# EAGLE schematic V2-1layer (EAGLE 9.6.2)
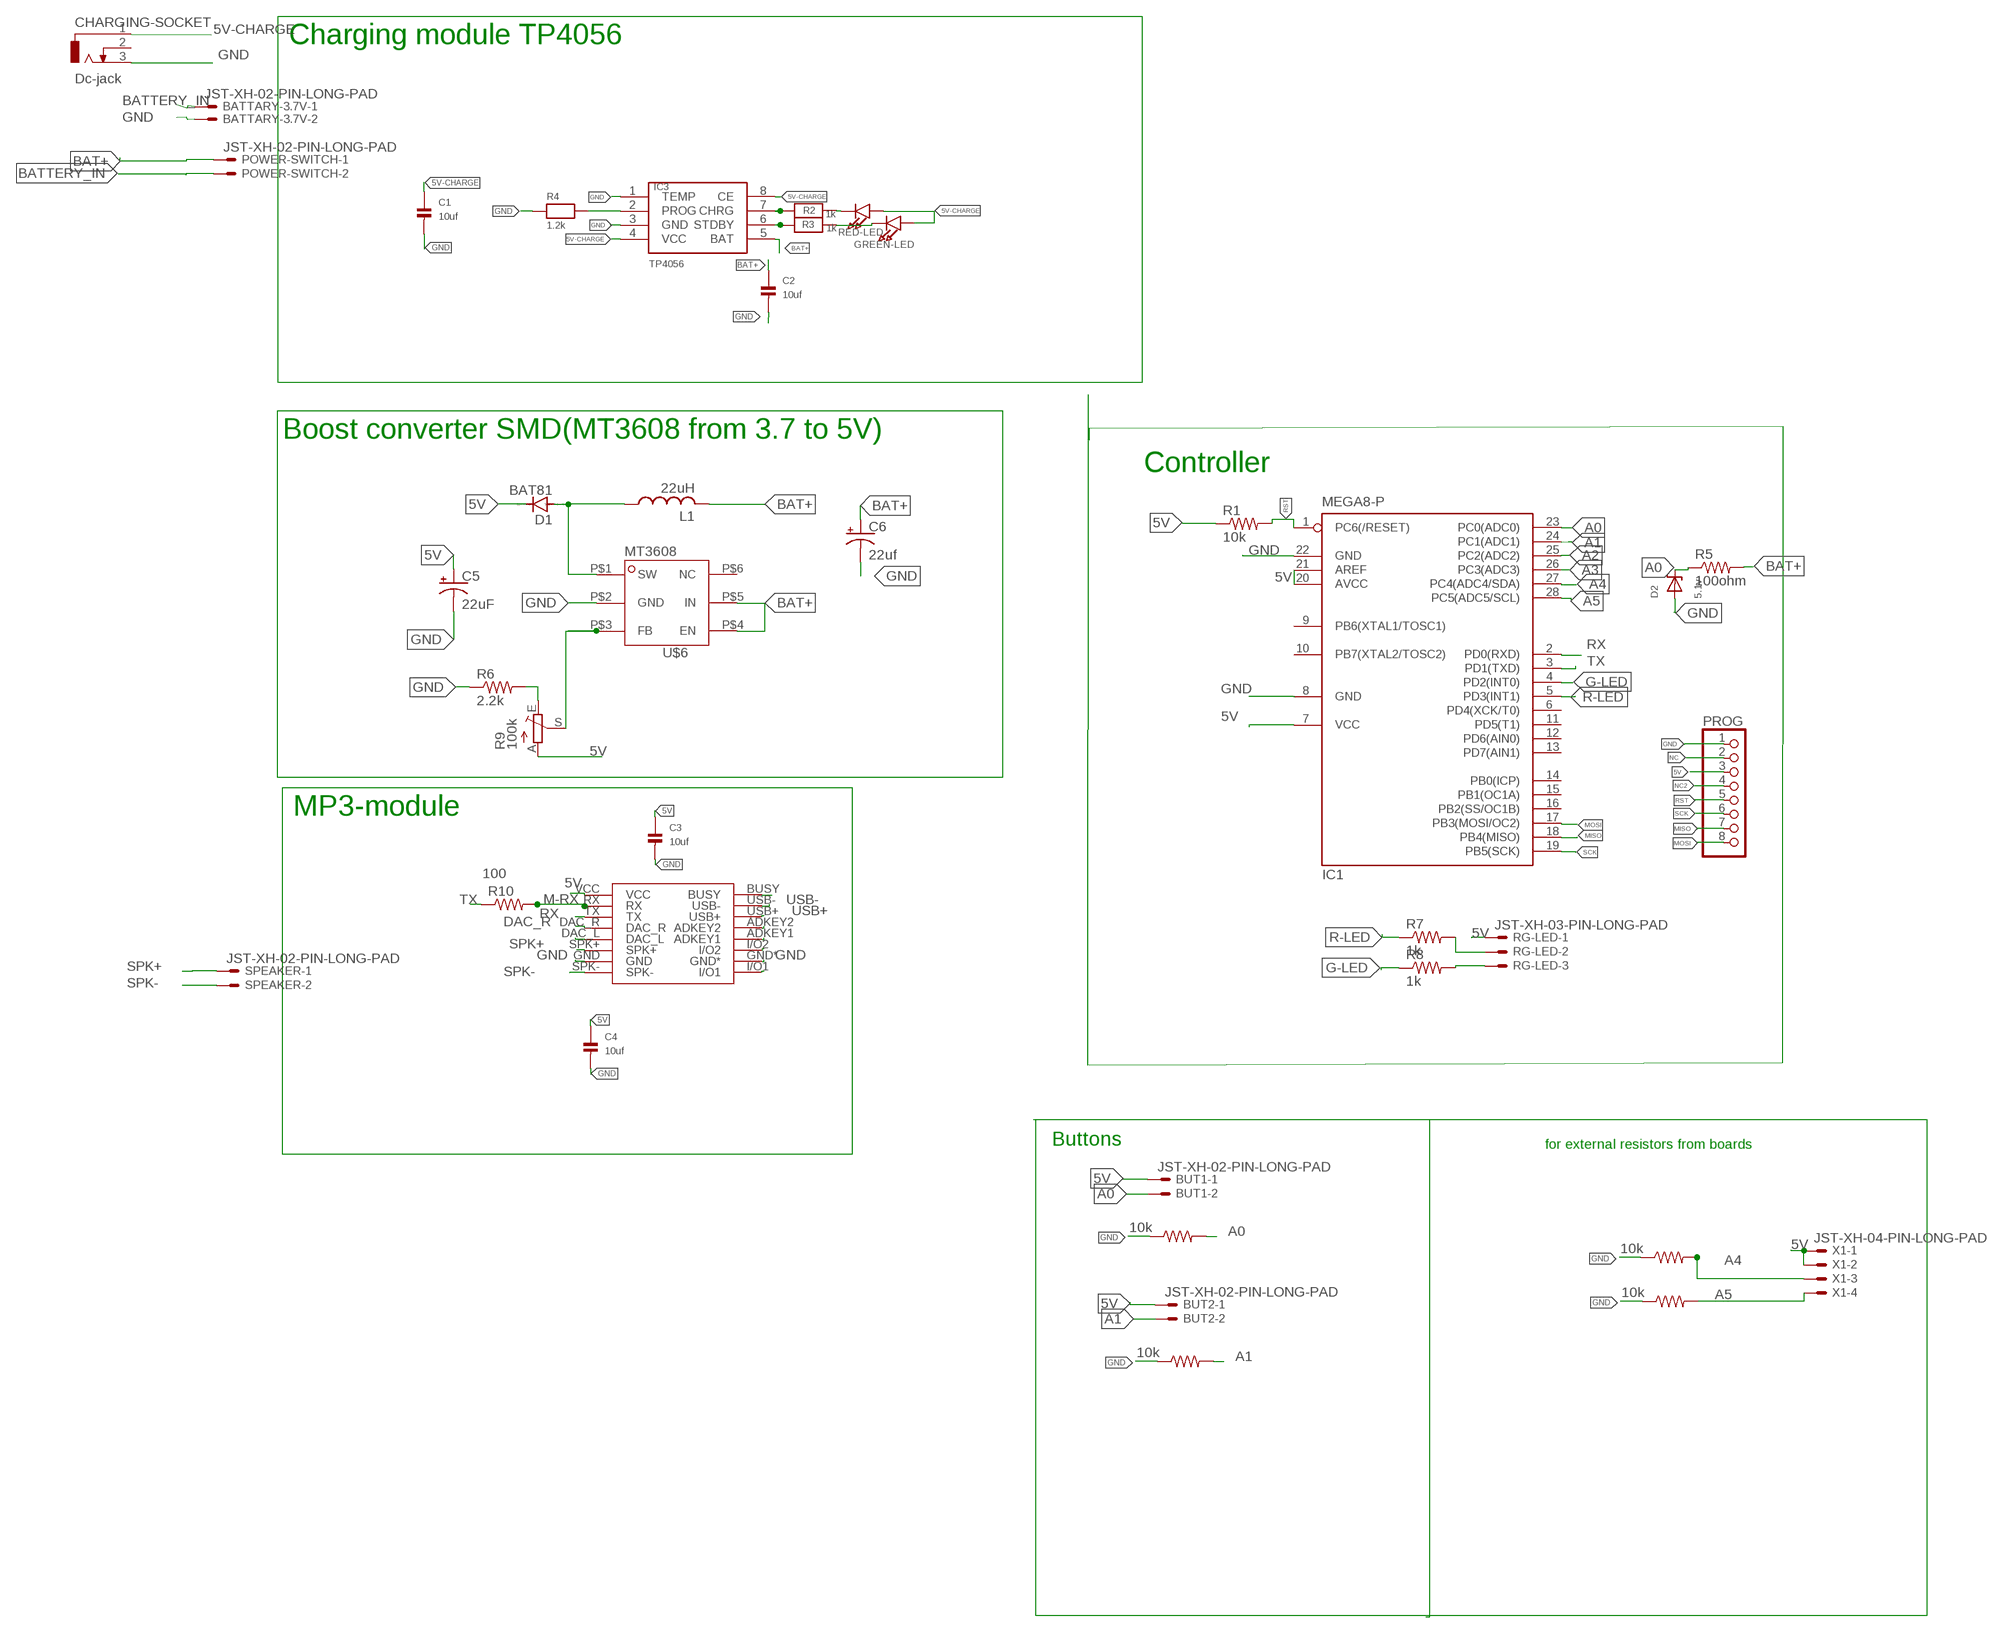
[diagram p0: schematic, sheet 1]

## Parts
BATTARY-3.7V  JST-XH-02-PIN-LONG-PAD  [JST-XH-02-PACKAGE-LONG-PAD]
BUT1  JST-XH-02-PIN-LONG-PAD  [JST-XH-02-PACKAGE-LONG-PAD]
BUT2  JST-XH-02-PIN-LONG-PAD  [JST-XH-02-PACKAGE-LONG-PAD]
C1  10uf  CAP_CERAMIC0805  [0805]
C2  10uf  CAP_CERAMIC0805  [0805]
C3  10uf  CAP_CERAMIC0805  [0805]
C4  10uf  CAP_CERAMIC0805  [0805]
C5  22uF  CPOL-USE2,5-6E  [E2,5-6E]
C6  22uf  CPOL-USE2,5-6E  [E2,5-6E]
CHARGING-SOCKET  Dc-jack  CON_JACK  [DCJ0303]
D1  BAT81  [DO34-7]
D2  5.1v  DIODE-ZENER  [SMADIODE]
GREEN-LED  LED0805  [CHIPLED_0805]
IC1  MEGA8-P  [DIL28-3]
IC3  TP4056  [SOP-8]
KEYPADS  10k  RES-7  [0204/7]
KEYPADS1  10k  RES-7  [0204/7]
KEYPADS2  10k  RES-7  [0204/7]
KEYPADS3  10k  RES-7  [0204/7]
L1  22uH  L-USL1812  [L1812]
POWER-SWITCH  JST-XH-02-PIN-LONG-PAD  [JST-XH-02-PACKAGE-LONG-PAD]
PROG  PINHD-1X8  [1X08]
R1  10k  R-US_0204/7  [0204/7]
R2  1k  RESISTOR_0805  [_0805]
R3  1k  RESISTOR_0805  [_0805]
R4  1.2k  RESISTOR_0805  [_0805]
R5  100ohm  R-US_0204/7  [0204/7]
R6  2.2k  R-US_M0805  [M0805]
R7  1k  R-US_0204/7  [0204/7]
R8  1k  R-US_0204/7  [0204/7]
R9  100k  TRIM_EU-B25U  [B25U]
R10  100  RES-7  [0204/7]
RED-LED  LED0805  [CHIPLED_0805]
RG-LED  JST-XH-03-PIN-LONG-PAD  [JST-XH-03-PACKAGE-LONG-PAD]
SPEAKER  JST-XH-02-PIN-LONG-PAD  [JST-XH-02-PACKAGE-LONG-PAD]
U$2  MP3_MODULE  [MP3_MODULE]
U$6  MT3608SOT23-6  [SOT23-6]
X1  JST-XH-04-PIN-LONG-PAD  [JST-XH-04-PACKAGE-LONG-PAD]

## Nets
5V: BUT1.1 BUT2.1 C3.1 C4.1 C5.+ D1.C IC1.7(VCC) IC1.20(AVCC) IC1.21(AREF) PROG.3 R1.1 R9.A RG-LED.1 U$2.VCC X1.1 X1.2
5V-CHARGE: C1.1 CHARGING-SOCKET.1 GREEN-LED.A IC3.4(VCC) IC3.8(CE) RED-LED.A
A0: BUT1.2 D2.C IC1.23(PC0(ADC0)) KEYPADS.2 R5.1
A1: BUT2.2 IC1.24(PC1(ADC1)) KEYPADS3.2
A2: IC1.25(PC2(ADC2))
A3: IC1.26(PC3(ADC3))
A4: IC1.27(PC4(ADC4/SDA)) KEYPADS1.2 X1.3
A5: IC1.28(PC5(ADC5/SCL)) KEYPADS2.2 X1.4
BAT+: C2.1 C6.+ IC3.5(BAT) L1.2 POWER-SWITCH.1 R5.2 U$6.P$4(EN) U$6.P$5(IN)
BATTERY_IN: BATTARY-3.7V.1 POWER-SWITCH.2
DAC_L: U$2.DAC_L
DAC_R: U$2.DAC_R
G-LED: IC1.4(PD2(INT0)) R8.1
GND: BATTARY-3.7V.2 C1.2 C2.2 C3.2 C4.2 C5.- C6.- CHARGING-SOCKET.3 D2.A IC1.8(GND) IC1.22(GND) IC3.1(TEMP) IC3.3(GND) KEYPADS1.1 KEYPADS2.1 KEYPADS3.1 KEYPADS.1 PROG.1 R4.1 R6.1 U$2.GND U$2.GND* U$6.P$2(GND)
M-RX: R10.2 U$2.RX
MISO: IC1.18(PB4(MISO)) PROG.7
MOSI: IC1.17(PB3(MOSI/OC2)) PROG.8
N$5: IC3.2(PROG) R4.2
N$7: R7.2 RG-LED.2
N$8: U$2.BUSY
N$11: U$2.ADKEY2
N$12: U$2.ADKEY1
N$13: U$2.I/O2
N$15: U$2.I/O1
N$16: R8.2 RG-LED.3
N$17: IC3.7(CHRG) R2.1
N$18: IC3.6(STDBY) R3.1
N$20: GREEN-LED.C R3.2
N$21: R6.2 R9.E
N$22: R2.2 RED-LED.C
N$24: R9.S U$6.P$3(FB)
N$30: D1.A L1.1 U$6.P$1(SW)
NC: PROG.2
NC2: PROG.4
R-LED: IC1.5(PD3(INT1)) R7.1
RST: IC1.1(PC6(/RESET)) PROG.5 R1.2
RX: IC1.2(PD0(RXD)) U$2.TX
SCK: IC1.19(PB5(SCK)) PROG.6
SPK+: SPEAKER.1 U$2.SPK+
SPK-: SPEAKER.2 U$2.SPK-
TX: IC1.3(PD1(TXD)) R10.1
USB+: U$2.USB+
USB-: U$2.USB-
Unconnected: CHARGING-SOCKET.2 IC1.6(PD4(XCK/T0)) IC1.9(PB6(XTAL1/TOSC1)) IC1.10(PB7(XTAL2/TOSC2)) IC1.11(PD5(T1)) IC1.12(PD6(AIN0)) IC1.13(PD7(AIN1)) IC1.14(PB0(ICP)) IC1.15(PB1(OC1A)) IC1.16(PB2(SS/OC1B)) U$6.P$6(NC)

## Notes on the sheet
- Charging module TP4056
- Boost converter SMD(MT3608 from 3.7 to 5V)
- Controller
- MP3-module
- Buttons | for external resistors from boards

## Library data of the parts
BATTARY-3.7V BUT1 BUT2 POWER-SWITCH SPEAKER = connector-data - JST XH Connectors v1-0:JST-XH-02-PIN: JST XH Connector 2 Pin Wire to board connector. Pitch: 2,54 mm, (0.100") Number of pins: 2 Created by Rembrandt Electronics www.rembrandtelectronics.com
C1-C4 = microbuilder:CAP_CERAMIC: Ceramic Capacitors 0402 - 0402 Surface Mount Capacitors 16pF 50V 5% [Digikey: 445-4899-2-ND] 18pF 50V 5% [Digikey: 490-1281-2-ND] 22pF 50V 5% [Digikey: 490-1283-2-ND] 68pF 50V 5% [Digikey: 490-1289-2-ND] 0.1uF 10V 10% [Digikey: 490-1318-2-ND] 1.0uF 6.3V 10% [Digikey: 490-1320-2-ND] 0603 - 0603 Surface Mount Capacitors 16 pF 50V 5% [Digikey: 445-5051-2-ND] 22 pF 50V [Digikey: PCC220ACVTR-ND] 33 pF 50V 5% [Digikey: 490-1415-1-ND] 56pF 50V 5% [Digikey: 490-1421-1-ND] 220pF 50V 5% [Digikey: 445-1285-1-ND] 680 pF 50V 2200 pF 50V 5% C0G [Digikey: 445-1297-1-ND] 5600 pF 100V 5% X7R [Digikey: 478-3711-1-ND] 0.1 µF 25V 10% [Digikey: PCC2277TR-ND] 0.22 µF 16V 10% X7R [Digikey: 445-1318-1-ND] 1.0 µF 25V 10% [Digikey: 445-5146-2-ND] 0603 - RF Specific 3pF 250V +/-0.1pF RF [Digikey: 712-1347-1-ND] 18 pF 250V 5% [Digikey: 478-3505-1-ND or 712-1322-1-ND] 56 pF 250V 5% C0G RF [Digikey: 490-4867-1-ND] 68 pF 250V RF [Digikey: 490-4868-1-ND] 0805 - 0805 Surface Mount Capacitors 220 pF 250V 2% RF Ceramic Capacitor [Digikey: 712-1398-1-ND] 1000 pF 50V 2% NP0 Ceramic Capacitor [Digikey: 478-3760-1-ND] 0.1 µF 25V 10% Ceramic Capacitor [Digikey: PCC1828TR-ND] 1.0 µF 16V 10% Ceramic Capacitor[Digikey: 490-1691-2-ND] 10.0 µF 10V 10% Ceramic Capacitor[Digikey: 709-1228-1-ND] 10.0 uF 16V 10% Ceramic Capacitor [Digikey: 478-5165-2-ND] 47 uF 6.3V 20% Ceramic Capacitor [Digikey: 587-1779-1-ND or 399-5506-1-ND] 1206 - 1206 Surface Mount Capacitors 47uF 10V 20% Ceramic Capacitor [Digikey: 490-5528-1-ND or 399-5508-1-ND or 445-6010-1-ND] 100uF 6.3V -20%, +80% Y5V Ceramic Capacitor (Digikey: 490-4512-1-ND, Mouser: 81-GRM31CF50J107ZE1L)
C5 C6 = rcl:CPOL-US: POLARIZED CAPACITOR, American symbol; SPICEPREFIX: C
CHARGING-SOCKET = MIA_LIBRARY-2-2:CON_JACK: DC POWER JACK Source: DCJ0303.pdf; OC_FARNELL: unknown; OC_NEWARK: unknown
D1 = diode:BAT81: DIODE barrier diode
D2 = microbuilder:DIODE-ZENER: Zener Diode SMA: 30V 1W Zener Diode, 1.2Vf - Digikey: SMAZ30-FDICT-ND
GREEN-LED RED-LED = microbuilder:LED: LED 0603 - 0603 Surface Mount Package 2mA: Green LED - Low Power (3.9mcd, 2ma, 1.7Vf) - Digikey: 475-2709-2-ND Orange LED - Low Power (9.8mcd, 2ma, 1.8Vf) - Digikey: 475-1194-2-ND Red LED - Low Power (5mcd, 2ma, 1.8Vf) - Digikey: 475-1195-2-ND Yellow LED - Low Power (7mcd, 2ma, 1.8Vf) - Digikey: 475-1196-2-ND 5mA: Blue LED - Low Power (17mcd, 5ma, 2.9Vf) - Digikey: LNJ937W8CRACT-ND 0805 - 0805 Surface Mount Package 2mA: Red LED (8.8mcd, 2mA, 1.8Vf, Clear) - Low Power [Digikey: 475-2510-1-ND] Green LED (5mcd, 2mA, 1.8Vf, Clear) - Low Power [Digikey: 475-2730-1-ND] Yellow LED (11.3mcd, 2mA, 1.8Vf, Clear) - Low Power [Digikey: 475-2555-1-ND] 20mA: Red LED (104mcd, 20mA, Diffused) - LS R976 [Digikey: 475-1278-6-ND] Red LED (12mcd, 20mA, 2.0Vf, Clear) - APT2012EC [Digikey: 754-1128-1-ND] Green LED (15mcd, 20mA, 2.2Vf, Clear) - APT2012GC [Digikey: 754-1131-1-ND] Orange LED (160mcd, 20mA, 2.1Vf, Clear) - APT2012SECK [Digikey: 754-1130-1-ND] 1206 - 1206 Surface Mount Package Green LED (26mcd, 20mA, Diffused) - LG N971 [Digikey: 475-1407-6-ND] Red LED (15mcd, 20mA, Diffused) - LH N974 [Digikey: 475-1416-6-ND]
IC1 = atmel:MEGA8-P: MICROCONTROLLER 8 Kbytes FLASH, 1 kbytes SRAM, 512 bytes EEPROM, USART, 4-channel 10 bit ADC, 2-channel 8 bit ADC Pin compatible with Atmega48, ATMega88, ATMega168 Source: avr.lbr; OC_FARNELL: unknown; OC_NEWARK: unknown
IC3 = TP4056:TP4056
KEYPADS KEYPADS1-KEYPADS3 R10 = MIA_LIBRARY-2-2:RES-7
L1 = rcl:L-US: INDUCTOR, American symbol; SPICEPREFIX: L
PROG = pinhead:PINHD-1X8: PIN HEADER
R1 R5-R8 = rcl:R-US_: RESISTOR, American symbol; SPICEPREFIX: R
R2-R4 = microbuilder:RESISTOR: Resistors 0402 - 0402 Surface Mount Package 22 Ohm 1% 1/16W [Digikey: 311-22.0LRTR-ND] 33 Ohm 5% 1/16W 1.0K 5% 1/16W 1.5K 5% 1/16W 2.0K 1% 1/16W 10.0K 1% 1/16W [Digikey: 311-10.0KLRTR-ND] 10.0K 5% 1/16W [Digikey: RMCF0402JT10K0TR-ND] 12.1K 1% 1/16W [Digikey: 311-22.0LRTR-ND] 100.0K 5% 1/16W 0603 - 0603 Surface Mount Package 0 Ohm 1/10 Watt 1% Resistor 15 Ohm 1/10 Watt 1% Resistor 33 Ohm 1/10 Watt 1% Resistor 49.9 Ohm 1/10 Watt 1% Resistor 100 Ohm 1/10 Watt 1% Resistor 150 Ohm 1/10 Watt 1% Resistor 240 Ohm 1/10 Watt 1% Resistor 390 Ohm 1/10 Watt 1% Resistor 560 Ohm 1/10 Watt 1% Resistor 680 Ohm 1/10 Watt 1% Resistor 750 Ohm 1/10 Watt 1% Resistor 1.0K Ohm 1/10 Watt 1% Resistor 1.5K Ohm 1/10 Watt 1% Resistor 2.0K Ohm 1/10 Watt 1% Resistor 2.2K Ohm 1/10 Watt 1% Resistor 3.3K Ohm 1/10 Watt 1% Resistor 4.7K Ohm 1/10 Watt 1% Resistor 10.0K Ohm 1/10 Watt 1% Resistor 12.0K Ohm 1/10 Watt 1% Resistor 12.1K Ohm 1/10 Watt 1% Resistor 20.0K Ohm 1/10 Watt 1% Resistor 33.0K Ohm 1/10 Watt 1% Resistor 100.0K Ohm 1/10 Watt 1% Resistor 0805 - 0805 Surface Mount Package 0 Ohm 1/8 Watt 1% Resistor 33 Ohm 1/8 Watt 1% Resistor 100 Ohm 1/8 Watt 1% Resistor 150 Ohm 1/8 Watt 1% Resistor 200 Ohm 1/8 Watt 1% Resistor 240 Ohm 1/8 Watt 1% Resistor 330 Ohm 1/8 Watt 1% Resistor 390 Ohm 1/8 Watt 1% Resistor 470 Ohm 1/8 Watt 1% Resistor 1.0K Ohm 1/8 Watt 1% Resistor 1.5K Ohm 1/8 Watt 1% Resistor 2.0K Ohm 1/8 Watt 1% Resistor 4.7K Ohm 1/8 Watt 1% Resistor 5.1K Ohm 1/8 Watt 1% Resistor 5.6K Ohm 1/8 Watt 1% Resistor 10.0K Ohm 1/8 Watt 1% Resistor 22.0K Ohm 1/8 Watt 1% Resistor 33.0K Ohm 1/8 Watt 1% Resistor 100K Ohm 1/8 Watt 1% Resistor 1206 - 1206 Surface Mount Package 2012 - 2010 Surface Mount Package 0.11 Ohm 1/2 Watt 1% Resistor - Digikey: RHM.11UCT-ND
R9 = pot:TRIM_EU-: POTENTIOMETER
RG-LED = connector-data - JST XH Connectors v1-0:JST-XH-03-PIN: JST XH Connector 2 Pin Wire to board connector. Pitch: 2,54 mm, (0.100") Number of pins: 3 Created by Rembrandt Electronics www.rembrandtelectronics.com
U$2 = MIA_LIBRARY-2-2:MP3_MODULE
U$6 = MT3608:MT3608: MT3608 High Efficiency 1.2MHz 2A Step Up Converter BY: Rangana Tennakoon
X1 = connector-data - JST XH Connectors v1-0:JST-XH-04-PIN: JST XH Connector 2 Pin Wire to board connector. Pitch: 2,54 mm, (0.100") Number of pins: 4 Created by Rembrandt Electronics www.rembrandtelectronics.com